# Altium schematic sheet MISC.SchDoc
size A3
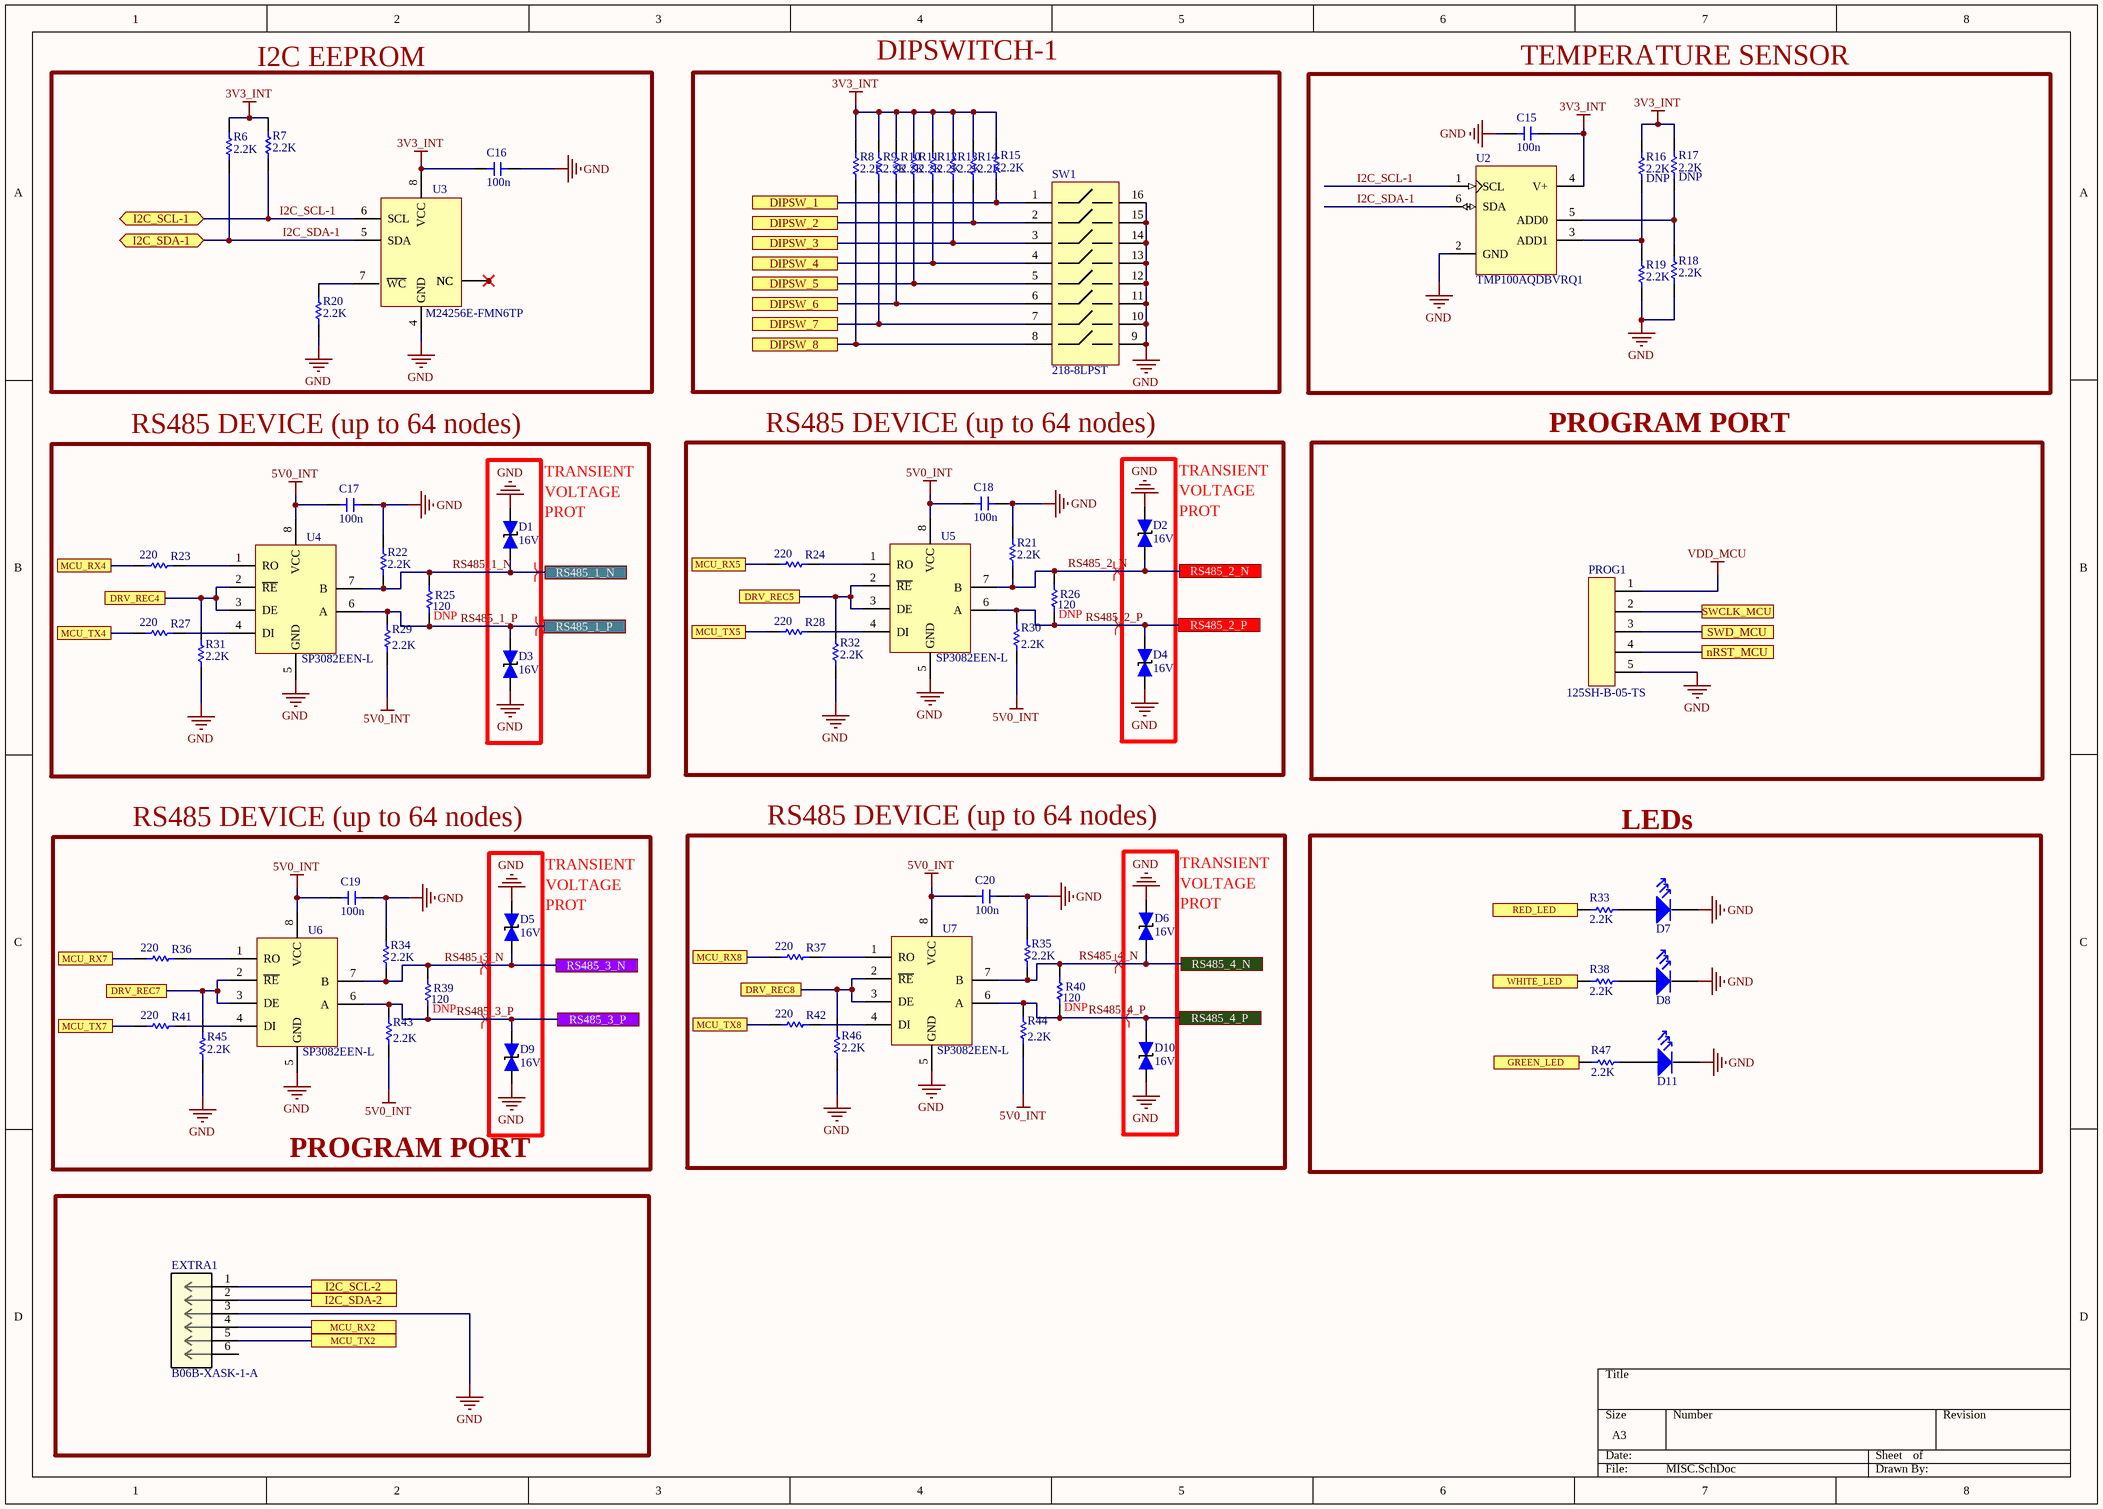
[diagram p0: MISC.SchDoc]

## Parts
C15  value 100n  [CAP_0402_CER]  (hidden comment: CL05B104KP5NNNC)
C16  value 100n  [CAP_0402_CER]  (hidden comment: CL05B104KP5NNNC)
C17  value 100n  [CAP_0402_CER]  (hidden comment: CL05B104KP5NNNC)
C18  value 100n  [CAP_0402_CER]  (hidden comment: CL05B104KP5NNNC)
C19  value 100n  [CAP_0402_CER]  (hidden comment: CL05B104KP5NNNC)
C20  value 100n  [CAP_0402_CER]  (hidden comment: CL05B104KP5NNNC)
D1  value 16V  [SOD-123F]  (hidden comment: SMF16CA)
D2  value 16V  [SOD-123F]  (hidden comment: SMF16CA)
D3  value 16V  [SOD-123F]  (hidden comment: SMF16CA)
D4  value 16V  [SOD-123F]  (hidden comment: SMF16CA)
D5  value 16V  [SOD-123F]  (hidden comment: SMF16CA)
D6  value 16V  [SOD-123F]  (hidden comment: SMF16CA)
D7  *  [LED_0805_SMD]  (value not drawn)
D8  *  [LED_0805_SMD]  (value not drawn)
D9  value 16V  [SOD-123F]  (hidden comment: SMF16CA)
D10  value 16V  [SOD-123F]  (hidden comment: SMF16CA)
D11  *  [LED_0805_SMD]  (value not drawn)
EXTRA1  B06B-XASK-1-A  [conn6_2132415-6_TEC]
PROG1  125SH-B-05-TS  [1.25_ST_5POS_THT]
R6  value 2.2K  [RES_0402_SMD]  (hidden comment: RMCF0402JT2K20)
R7  value 2.2K  [RES_0402_SMD]  (hidden comment: RMCF0402JT2K20)
R8  value 2.2K  [RES_0402_SMD]  (hidden comment: RMCF0402JT2K20)
R9  value 2.2K  [RES_0402_SMD]  (hidden comment: RMCF0402JT2K20)
R10  value 2.2K  [RES_0402_SMD]  (hidden comment: RMCF0402JT2K20)
R11  value 2.2K  [RES_0402_SMD]  (hidden comment: RMCF0402JT2K20)
R12  value 2.2K  [RES_0402_SMD]  (hidden comment: RMCF0402JT2K20)
R13  value 2.2K  [RES_0402_SMD]  (hidden comment: RMCF0402JT2K20)
R14  value 2.2K  [RES_0402_SMD]  (hidden comment: RMCF0402JT2K20)
R15  value 2.2K  [RES_0402_SMD]  (hidden comment: RMCF0402JT2K20)
R16  value 2.2K  Place: DNP  [RES_0402_SMD]  (hidden comment: RMCF0402JT2K20)
R17  value 2.2K  Place: DNP  [RES_0402_SMD]  (hidden comment: RMCF0402JT2K20)
R18  value 2.2K  [RES_0402_SMD]  (hidden comment: RMCF0402JT2K20)
R19  value 2.2K  [RES_0402_SMD]  (hidden comment: RMCF0402JT2K20)
R20  value 2.2K  [RES_0402_SMD]  (hidden comment: RMCF0402JT2K20)
R21  value 2.2K  [RES_0402_SMD]  (hidden comment: RMCF0402JT2K20)
R22  value 2.2K  [RES_0402_SMD]  (hidden comment: RMCF0402JT2K20)
R23  value 220  [RES_0402_SMD]  (hidden comment: RMCF0402JT220R)
R24  value 220  [RES_0402_SMD]  (hidden comment: RMCF0402JT220R)
R25  value 120  Place: DNP  [RES_0805_SMD]  (hidden comment: ESR10EZPJ121)
R26  value 120  Place: DNP  [RES_0805_SMD]  (hidden comment: ESR10EZPJ121)
R27  value 220  [RES_0402_SMD]  (hidden comment: RMCF0402JT220R)
R28  value 220  [RES_0402_SMD]  (hidden comment: RMCF0402JT220R)
R29  value 2.2K  [RES_0402_SMD]  (hidden comment: RMCF0402JT2K20)
R30  value 2.2K  [RES_0402_SMD]  (hidden comment: RMCF0402JT2K20)
R31  value 2.2K  [RES_0402_SMD]  (hidden comment: RMCF0402JT2K20)
R32  value 2.2K  [RES_0402_SMD]  (hidden comment: RMCF0402JT2K20)
R33  value 2.2K  [RES_0402_SMD]  (hidden comment: RMCF0402JT2K20)
R34  value 2.2K  [RES_0402_SMD]  (hidden comment: RMCF0402JT2K20)
R35  value 2.2K  [RES_0402_SMD]  (hidden comment: RMCF0402JT2K20)
R36  value 220  [RES_0402_SMD]  (hidden comment: RMCF0402JT220R)
R37  value 220  [RES_0402_SMD]  (hidden comment: RMCF0402JT220R)
R38  value 2.2K  [RES_0402_SMD]  (hidden comment: RMCF0402JT2K20)
R39  value 120  Place: DNP  [RES_0805_SMD]  (hidden comment: ESR10EZPJ121)
R40  value 120  Place: DNP  [RES_0805_SMD]  (hidden comment: ESR10EZPJ121)
R41  value 220  [RES_0402_SMD]  (hidden comment: RMCF0402JT220R)
R42  value 220  [RES_0402_SMD]  (hidden comment: RMCF0402JT220R)
R43  value 2.2K  [RES_0402_SMD]  (hidden comment: RMCF0402JT2K20)
R44  value 2.2K  [RES_0402_SMD]  (hidden comment: RMCF0402JT2K20)
R45  value 2.2K  [RES_0402_SMD]  (hidden comment: RMCF0402JT2K20)
R46  value 2.2K  [RES_0402_SMD]  (hidden comment: RMCF0402JT2K20)
R47  value 2.2K  [RES_0402_SMD]  (hidden comment: RMCF0402JT2K20)
SW1  218-8LPST  [218-8LPST]
U2  TMP100AQDBVRQ1  [TSOT-23-6]
U3  M24256E-FMN6TP  [8-SOIC(0.154", 3.90mm Width)]
U4  SP3082EEN-L  [8-SOIC(0.154", 3.90mm Width)]
U5  SP3082EEN-L  [8-SOIC(0.154", 3.90mm Width)]
U6  SP3082EEN-L  [8-SOIC(0.154", 3.90mm Width)]
U7  SP3082EEN-L  [8-SOIC(0.154", 3.90mm Width)]

## Blocks framed on the sheet
I2C EEPROM: C16 R6 R7 R20 U3
DIPSWITCH-1: R8-R15 SW1
TEMPERATURE SENSOR: C15 R16-R19 U2
RS485 DEVICE (up to 64 nodes): C17 D1 D3 R22 R23 R25 R27 R29 R31 U4
RS485 DEVICE (up to 64 nodes): C18 D2 D4 R21 R24 R26 R28 R30 R32 U5
PROGRAM PORT: PROG1
RS485 DEVICE (up to 64 nodes): C20 D6 D10 R35 R37 R40 R42 R44 R46 U7
LEDs: D7 D8 D11 R33 R38 R47

## Ports
DIPSW_1, DIPSW_2, DIPSW_3, DIPSW_4, DIPSW_5, DIPSW_6, DIPSW_7, DIPSW_8, DRV_REC4, DRV_REC5, DRV_REC7, DRV_REC8, GREEN_LED, I2C_SCL-1 (bidir), I2C_SCL-2, I2C_SDA-1 (bidir), I2C_SDA-2, MCU_RX2, MCU_RX4, MCU_RX5, MCU_RX7, MCU_RX8, MCU_TX2, MCU_TX4, MCU_TX5, MCU_TX7, MCU_TX8, nRST_MCU, RED_LED, RS485_1_N, RS485_1_P, RS485_2_N, RS485_2_P, RS485_3_N, RS485_3_P, RS485_4_N, RS485_4_P, SWCLK_MCU, SWD_MCU, WHITE_LED

## Nets
3V3_INT: C15.1 C16.2 R6.2 R7.2 R8.2 R9.2 R10.2 R11.2 R12.2 R13.2 R14.2 R15.2 R16.2 R17.2 U2.4(V+) U3.8(VCC)
5V0_INT: C17.2 C18.2 C19.2 C20.2 R29.1 R30.1 R43.1 R44.1 U4.8(VCC) U5.8(VCC) U6.8(VCC) U7.8(VCC)
GND: C15.2 C16.1 C17.1 C18.1 C19.1 C20.1 D1.2(A) D2.2(A) D3.2(A) D4.2(A) D5.2(A) D6.2(A) D7.C D8.C D9.2(A) D10.2(A) D11.C EXTRA1.3 PROG1.5 R18.1 R19.1 R20.1 R21.2 R22.2 R31.1 R32.1 R34.2 R35.2 R45.1 R46.1 SW1.9 SW1.10 SW1.11 SW1.12 SW1.13 SW1.14 SW1.15 SW1.16 U2.2(GND) U3.4(GND) U4.5(GND) U5.5(GND) U6.5(GND) U7.5(GND)
VDD_MCU: PROG1.1
DIPSW_1: R15.1 SW1.1 ; port DIPSW_1
DIPSW_2: R14.1 SW1.2 ; port DIPSW_2
DIPSW_3: R13.1 SW1.3 ; port DIPSW_3
DIPSW_4: R12.1 SW1.4 ; port DIPSW_4
DIPSW_5: R11.1 SW1.5 ; port DIPSW_5
DIPSW_6: R10.1 SW1.6 ; port DIPSW_6
DIPSW_7: R9.1 SW1.7 ; port DIPSW_7
DIPSW_8: R8.1 SW1.8 ; port DIPSW_8
DRV_REC4: R31.2 U4.2(~{RE}) U4.3(DE) ; port DRV_REC4
DRV_REC5: R32.2 U5.2(~{RE}) U5.3(DE) ; port DRV_REC5
DRV_REC7: R45.2 U6.2(~{RE}) U6.3(DE) ; port DRV_REC7
DRV_REC8: R46.2 U7.2(~{RE}) U7.3(DE) ; port DRV_REC8
GREEN_LED: R47.2 ; port GREEN_LED
I2C_SCL-1: R7.1 U2.1(SCL) U3.6(SCL) ; port I2C_SCL-1
I2C_SCL-2: EXTRA1.1 ; port I2C_SCL-2
I2C_SDA-1: R6.1 U2.6(SDA) U3.5(SDA) ; port I2C_SDA-1
I2C_SDA-2: EXTRA1.2 ; port I2C_SDA-2
MCU_RX2: EXTRA1.4 ; port MCU_RX2
MCU_RX4: R23.2 ; port MCU_RX4
MCU_RX5: R24.2 ; port MCU_RX5
MCU_RX7: R36.2 ; port MCU_RX7
MCU_RX8: R37.2 ; port MCU_RX8
MCU_TX2: EXTRA1.5 ; port MCU_TX2
MCU_TX4: R27.2 ; port MCU_TX4
MCU_TX5: R28.2 ; port MCU_TX5
MCU_TX7: R41.2 ; port MCU_TX7
MCU_TX8: R42.2 ; port MCU_TX8
nRST_MCU: PROG1.4 ; port nRST_MCU
RED_LED: R33.2 ; port RED_LED
RS485_1_N: D1.1(C) R22.1 R25.1 U4.7(B) ; port RS485_1_N
RS485_1_P: D3.1(C) R25.2 R29.2 U4.6(A) ; port RS485_1_P
RS485_2_N: D2.1(C) R21.1 R26.1 U5.7(B) ; port RS485_2_N
RS485_2_P: D4.1(C) R26.2 R30.2 U5.6(A) ; port RS485_2_P
RS485_3_N: D5.1(C) R34.1 R39.1 U6.7(B) ; port RS485_3_N
RS485_3_P: D9.1(C) R39.2 R43.2 U6.6(A) ; port RS485_3_P
RS485_4_N: D6.1(C) R35.1 R40.1 U7.7(B) ; port RS485_4_N
RS485_4_P: D10.1(C) R40.2 R44.2 U7.6(A) ; port RS485_4_P
SWCLK_MCU: PROG1.2 ; port SWCLK_MCU
SWD_MCU: PROG1.3 ; port SWD_MCU
WHITE_LED: R38.2 ; port WHITE_LED
NetD7_A: D7.A R33.1
NetD8_A: D8.A R38.1
NetD11_A: D11.A R47.1
NetR16_1: R16.1 R19.2 U2.3(ADD1)
NetR17_1: R17.1 R18.2 U2.5(ADD0)
NetR20_2: R20.2 U3.7(~{WC})
NetR23_1: R23.1 U4.1(RO)
NetR24_1: R24.1 U5.1(RO)
NetR27_1: R27.1 U4.4(DI)
NetR28_1: R28.1 U5.4(DI)
NetR36_1: R36.1 U6.1(RO)
NetR37_1: R37.1 U7.1(RO)
NetR41_1: R41.1 U6.4(DI)
NetR42_1: R42.1 U7.4(DI)
NetU3_1: U3.1(NC) U3.2(NC) U3.3(NC)

Not connected (* = marked no-connect by the designer): EXTRA1 6

## Layout directives
differential pair: RS485_1_N, RS485_1_P, RS485_2_N, RS485_2_P, RS485_3_N, RS485_3_P, RS485_4_N, RS485_4_P

## Notes on the sheet
- (near D1) TRANSIENT
- (near D1) VOLTAGE
- (near D1) PROT
- (near D2) TRANSIENT
- (near D2) VOLTAGE
- (near D2) PROT
- RS485 DEVICE (up to 64 nodes)
- (near D5) TRANSIENT
- (near D5) VOLTAGE
- (near D5) PROT
- (near D6) TRANSIENT
- (near D6) VOLTAGE
- (near D6) PROT
- PROGRAM PORT

## Library data of the parts
C15-C20 = CAP_GEN_CER: Generic; Voltage: 10V; Place: P; Part Number: CL05B104KP5NNNC; Power: *; Package: *; Tolerance: *; Operating Temp.: *
D1-D6 D9 D10 = SMF16CA: Unidirectional TVS DIODE 200W 16V-17.8V SOD-123; Manufacturer: ANBON SEMI; Voltage: 17.8V; Place: POP; Part Number: SMF16CA; Power: 200W; Tolerance: N/A; Package: SOD-123F; Operating Temp.: -55°C ~ 150°C
D7 = LED_GEN: Place: P; Part Number: *; Value: *; Voltage: *; Power: *; Tolerance: *; Package: *; Operating Temp.: *
D8 D11 = LED_GEN: Place: P/DNP; Part Number: *; Value: *; Voltage: *; Power: *; Tolerance: *; Package: *; Operating Temp.: *
EXTRA1 = 2132415-6: No Description Available; Mfr_Name: TE Connectivity; TYPE: Header; RefDes: RefDes
PROG1 = 125SH-B-05-TS: CONN HEADER VERT 5POS 1.25MM; Manufacturer: ADAMTECH; Value: 5POS-1.25mm; Place: DNP; Part Number: 125SH-B-05-TS; Voltage: N/A; Power: N/A; Tolerance: N/A; Package: 1.25; Operating Temp.: N/A
R6-R15 R18-R24 R27-R38 R41-R47 = RES_GEN_SMD: Generic Chip Res; Place: P; Package: *; Power: *; Tolerance: *; Voltage: *; Operating Temp.: *
  R6-R15 R18-R22 R29-R35 R38 R43-R47: Part Number: RMCF0402JT2K20
  R23 R24 R27 R28 R36 R37 R41 R42: Part Number: RMCF0402JT220R
R16 R17 R25 R26 R39 R40 = RES_GEN_SMD: Generic Chip Res; Package: *; Power: *; Tolerance: *; Voltage: *; Operating Temp.: *
  R16 R17: Part Number: RMCF0402JT2K20
  R25 R26 R39 R40: Part Number: ESR10EZPJ121
SW1 = 218-8LPST: Dip Switch SPST 8 Position Surface Mount Slide (Standard) Actuator 100mA 20VDC; Manufacturer: CST; Value: SPST-8POS; Place: POP; Tolerance: N/A; Voltage: N/A; Power: N/A; Part Number: 218-8LPST; Package: 218-8LPST; Operating Temp.: -40°C ~ 85°C
U2 = TMP100AQDBVRQ1: Temperature Sensor Digital; Value: -55°C ~ 125°C; Voltage: 2.7V ~ 5.5V; Tolerance: ±2°C; Place: POP; Part Number: TMP100AQDBVRQ1; Power: N/A; Package: SOT-23-6; Operating Temp.: -55°C ~ 125°C
U3 = M24256E-FMN6TP: IC EEPROM 256KBIT I2C 1MHZ 8SO; Manufacturer: STM; Voltage: 1.6V ~ 5.5V; Place: POP; Part Number: M24256E-FMN6TP; Value: 256Kbit; Power: N/A; Tolerance: N/A; Package: 8-SOIC; Operating Temp.: -40°C ~ 85°C
U4-U7 = SP3082EEN-L: 1/1 Transceiver Half RS422, RS485 8-SOIC; Manufacturer: MaxLinear, Inc.; Value: 256nodes; Voltage: 4.5V ~ 5.5V; Place: POP; Part Number: SP3082EEN-L; Power: N/A; Tolerance: N/A; Package: 8-SOIC; Operating Temp.: -40°C ~ 85°C